# Altium schematic sheet Top Level - BlackChat.SchDoc
size Letter
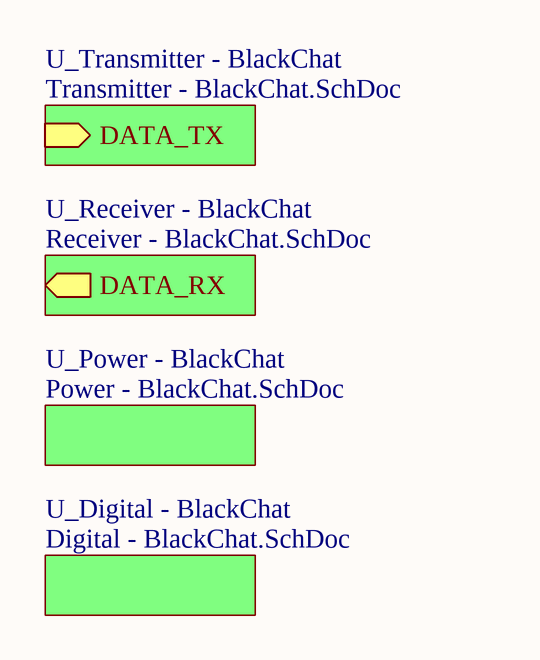
[diagram p0: Top Level - BlackChat.SchDoc]

## Sub-sheets
U_Digital - BlackChat = Digital - BlackChat.SchDoc: no entries
U_Power - BlackChat = Power - BlackChat.SchDoc: no entries
U_Receiver - BlackChat = Receiver - BlackChat.SchDoc: DATA_RX (out)
U_Transmitter - BlackChat = Transmitter - BlackChat.SchDoc: DATA_TX (in)